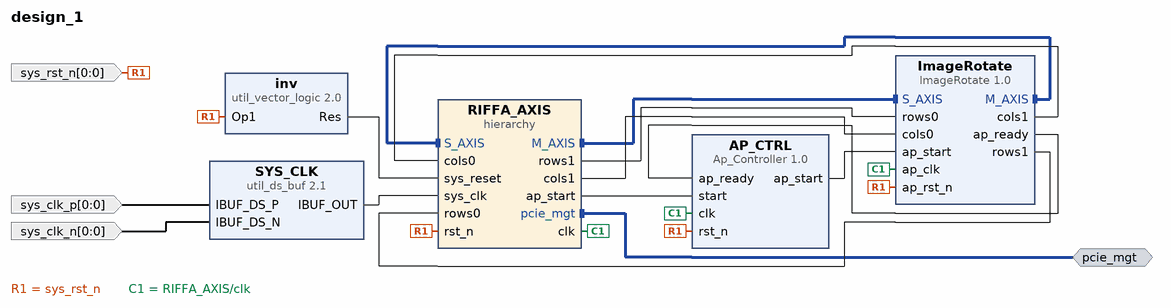
[diagram p0: block diagram of the top level]
# Vivado block design design_1, xc7vx690tffg1761-3, Vivado 2018.2
create_bd_design design_1

create_bd_intf_port -mode Master -vlnv xilinx.com:interface:pcie_7x_mgt_rtl:1.0 pcie_mgt
create_bd_port -dir I -from 0 -to 0 -type clk sys_clk_p
create_bd_port -dir I -from 0 -to 0 -type clk sys_clk_n
create_bd_port -dir I -from 0 -to 0 sys_rst_n

create_bd_cell -type hier RIFFA_AXIS
create_bd_cell -type ip -vlnv xilinx.com:ip:util_ds_buf:2.1 SYS_CLK
set_property -dict {CONFIG.C_BUF_TYPE IBUFDSGTE} [get_bd_cells SYS_CLK]
create_bd_cell -type ip -vlnv xilinx.com:hls:ImageRotate:1.0 ImageRotate
create_bd_cell -type ip -vlnv xilinx.com:user:Ap_Controller:1.0 AP_CTRL
create_bd_cell -type ip -vlnv xilinx.com:ip:util_vector_logic:2.0 inv
set_property -dict {CONFIG.C_SIZE 1 CONFIG.C_OPERATION not} [get_bd_cells inv]

# ---- hierarchy /RIFFA_AXIS ----
current_bd_instance /RIFFA_AXIS
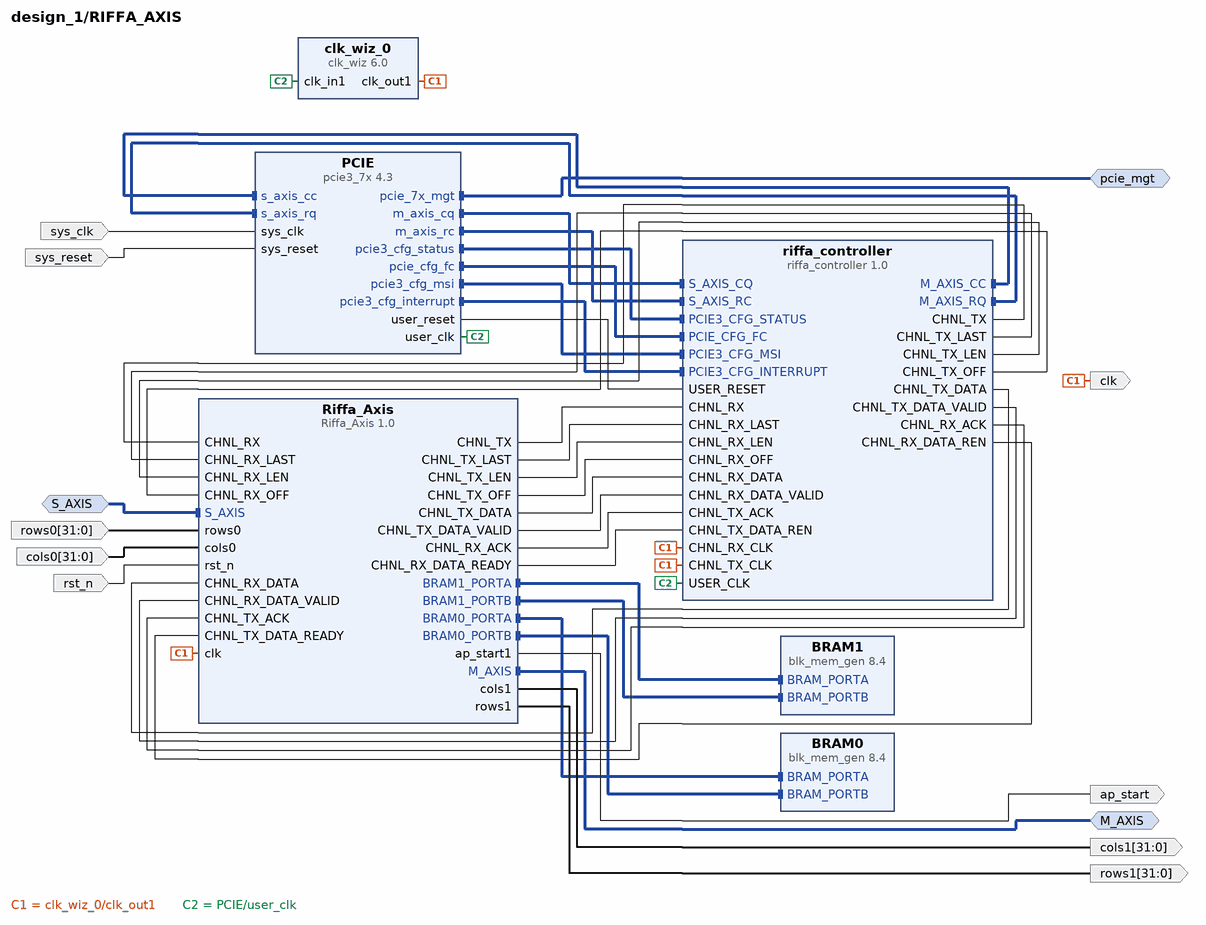
[diagram p1: block diagram inside /RIFFA_AXIS]
create_bd_intf_pin -mode Master -vlnv xilinx.com:interface:pcie_7x_mgt_rtl:1.0 pcie_mgt
create_bd_intf_pin -mode Master -vlnv xilinx.com:interface:axis_rtl:1.0 M_AXIS
create_bd_intf_pin -mode Slave -vlnv xilinx.com:interface:axis_rtl:1.0 S_AXIS
create_bd_pin -dir I -type clk sys_clk
create_bd_pin -dir I -type rst sys_reset
create_bd_pin -dir I -from 31 -to 0 rows0
create_bd_pin -dir I -from 31 -to 0 cols0
create_bd_pin -dir O -from 31 -to 0 rows1
create_bd_pin -dir O -from 31 -to 0 cols1
create_bd_pin -dir I -type rst rst_n
create_bd_pin -dir O -type clk clk
create_bd_pin -dir O ap_start

create_bd_cell -type ip -vlnv xilinx.com:ip:pcie3_7x:4.3 PCIE
set_property -dict [list \
  CONFIG.PL_LINK_CAP_MAX_LINK_SPEED 5.0_GT/s \
  CONFIG.PL_LINK_CAP_MAX_LINK_WIDTH X8 \
  CONFIG.AXISTEN_IF_RC_STRADDLE false \
  CONFIG.axisten_if_enable_client_tag false \
  CONFIG.PF0_DEVICE_ID 7028 \
  CONFIG.PF0_INTERRUPT_PIN NONE \
  CONFIG.PF1_DEVICE_ID 7011 \
  CONFIG.pcie_blk_locn X0Y1 \
  CONFIG.pf0_bar0_size 1 \
  CONFIG.pf0_dev_cap_max_payload 256_bytes \
  CONFIG.gen_x0y0 false \
  CONFIG.gen_x0y1 true \
  CONFIG.extended_tag_field true \
  CONFIG.axisten_if_width 128_bit \
  CONFIG.mode_selection Advanced \
  CONFIG.en_ext_clk false \
  CONFIG.tx_fc_if false \
  CONFIG.per_func_status_if false \
  CONFIG.cfg_mgmt_if false \
  CONFIG.rcv_msg_if false \
  CONFIG.cfg_tx_msg_if false \
  CONFIG.cfg_ctl_if false \
  CONFIG.tandem_mode None \
  CONFIG.axisten_freq 250 \
  CONFIG.aspm_support No_ASPM \
  CONFIG.pipe_mode_sim None \
] [get_bd_cells PCIE]
create_bd_cell -type ip -vlnv xilinx.com:user:riffa_controller:1.0 riffa_controller
create_bd_cell -type ip -vlnv xilinx.com:ip:blk_mem_gen:8.4 BRAM0
set_property -dict [list \
  CONFIG.Memory_Type Simple_Dual_Port_RAM \
  CONFIG.Enable_32bit_Address false \
  CONFIG.Use_Byte_Write_Enable false \
  CONFIG.Write_Width_A 8 \
  CONFIG.Write_Depth_A 65536 \
  CONFIG.Operating_Mode_A WRITE_FIRST \
  CONFIG.Enable_A Always_Enabled \
  CONFIG.Write_Width_B 128 \
  CONFIG.Read_Width_B 128 \
  CONFIG.Enable_B Use_ENB_Pin \
  CONFIG.Register_PortB_Output_of_Memory_Primitives false \
  CONFIG.Port_B_Clock 100 \
  CONFIG.Port_B_Enable_Rate 100 \
  CONFIG.use_bram_block Stand_Alone \
] [get_bd_cells BRAM0]
create_bd_cell -type ip -vlnv xilinx.com:ip:blk_mem_gen:8.4 BRAM1
set_property -dict [list \
  CONFIG.Memory_Type Simple_Dual_Port_RAM \
  CONFIG.Enable_32bit_Address false \
  CONFIG.Use_Byte_Write_Enable false \
  CONFIG.Write_Width_A 128 \
  CONFIG.Write_Depth_A 4096 \
  CONFIG.Operating_Mode_A NO_CHANGE \
  CONFIG.Enable_A Always_Enabled \
  CONFIG.Write_Width_B 8 \
  CONFIG.Read_Width_B 8 \
  CONFIG.Enable_B Use_ENB_Pin \
  CONFIG.Register_PortB_Output_of_Memory_Primitives false \
  CONFIG.Port_B_Clock 100 \
  CONFIG.Port_B_Enable_Rate 100 \
  CONFIG.use_bram_block Stand_Alone \
] [get_bd_cells BRAM1]
create_bd_cell -type ip -vlnv xilinx.com:ip:clk_wiz:6.0 clk_wiz_0
set_property -dict [list \
  CONFIG.PRIMITIVE PLL \
  CONFIG.PRIM_IN_FREQ 250.000 \
  CONFIG.CLKIN1_JITTER_PS 40.0 \
  CONFIG.CLKOUT1_REQUESTED_OUT_FREQ 50.000 \
  CONFIG.PRIM_SOURCE No_buffer \
  CONFIG.CLKOUT1_DRIVES BUFG \
  CONFIG.CLKOUT2_DRIVES BUFG \
  CONFIG.CLKOUT3_DRIVES BUFG \
  CONFIG.CLKOUT4_DRIVES BUFG \
  CONFIG.CLKOUT5_DRIVES BUFG \
  CONFIG.CLKOUT6_DRIVES BUFG \
  CONFIG.CLKOUT7_DRIVES BUFG \
  CONFIG.USE_LOCKED false \
  CONFIG.USE_RESET false \
  CONFIG.MMCM_DIVCLK_DIVIDE 5 \
  CONFIG.MMCM_CLKFBOUT_MULT_F 17 \
  CONFIG.MMCM_CLKIN1_PERIOD 4.000 \
  CONFIG.MMCM_CLKIN2_PERIOD 10.0 \
  CONFIG.MMCM_COMPENSATION ZHOLD \
  CONFIG.MMCM_CLKOUT0_DIVIDE_F 17 \
  CONFIG.CLKOUT1_JITTER 197.183 \
  CONFIG.CLKOUT1_PHASE_ERROR 155.540 \
] [get_bd_cells clk_wiz_0]
create_bd_cell -type ip -vlnv xilinx.com:user:Riffa_Axis:1.0 Riffa_Axis
set_property -dict {CONFIG.AP_CTRL_IN false} [get_bd_cells Riffa_Axis]

# ---- connections ----

current_bd_instance /RIFFA_AXIS
connect_bd_intf_net [get_bd_intf_pins Riffa_Axis/BRAM0_PORTA] [get_bd_intf_pins BRAM0/BRAM_PORTA]
connect_bd_intf_net [get_bd_intf_pins Riffa_Axis/BRAM0_PORTB] [get_bd_intf_pins BRAM0/BRAM_PORTB]
connect_bd_intf_net [get_bd_intf_pins Riffa_Axis/BRAM1_PORTA] [get_bd_intf_pins BRAM1/BRAM_PORTA]
connect_bd_intf_net [get_bd_intf_pins Riffa_Axis/BRAM1_PORTB] [get_bd_intf_pins BRAM1/BRAM_PORTB]
connect_bd_intf_net [get_bd_intf_pins PCIE/m_axis_cq] [get_bd_intf_pins riffa_controller/S_AXIS_CQ]
connect_bd_intf_net [get_bd_intf_pins PCIE/m_axis_rc] [get_bd_intf_pins riffa_controller/S_AXIS_RC]
connect_bd_intf_net [get_bd_intf_pins PCIE/s_axis_cc] [get_bd_intf_pins riffa_controller/M_AXIS_CC]
connect_bd_intf_net [get_bd_intf_pins riffa_controller/M_AXIS_RQ] [get_bd_intf_pins PCIE/s_axis_rq]
connect_bd_intf_net [get_bd_intf_pins riffa_controller/PCIE3_CFG_STATUS] [get_bd_intf_pins PCIE/pcie3_cfg_status]
connect_bd_intf_net [get_bd_intf_pins riffa_controller/PCIE_CFG_FC] [get_bd_intf_pins PCIE/pcie_cfg_fc]
connect_bd_intf_net [get_bd_intf_pins PCIE/pcie3_cfg_msi] [get_bd_intf_pins riffa_controller/PCIE3_CFG_MSI]
connect_bd_intf_net [get_bd_intf_pins PCIE/pcie3_cfg_interrupt] [get_bd_intf_pins riffa_controller/PCIE3_CFG_INTERRUPT]
connect_bd_intf_net [get_bd_intf_pins pcie_mgt] [get_bd_intf_pins PCIE/pcie_7x_mgt]
connect_bd_intf_net [get_bd_intf_pins M_AXIS] [get_bd_intf_pins Riffa_Axis/M_AXIS]
connect_bd_intf_net [get_bd_intf_pins S_AXIS] [get_bd_intf_pins Riffa_Axis/S_AXIS]
connect_bd_net [get_bd_pins riffa_controller/CHNL_TX] [get_bd_pins Riffa_Axis/CHNL_RX]
connect_bd_net [get_bd_pins riffa_controller/CHNL_TX_LAST] [get_bd_pins Riffa_Axis/CHNL_RX_LAST]
connect_bd_net [get_bd_pins riffa_controller/CHNL_TX_LEN] [get_bd_pins Riffa_Axis/CHNL_RX_LEN]
connect_bd_net [get_bd_pins riffa_controller/CHNL_TX_OFF] [get_bd_pins Riffa_Axis/CHNL_RX_OFF]
connect_bd_net [get_bd_pins riffa_controller/CHNL_TX_DATA] [get_bd_pins Riffa_Axis/CHNL_RX_DATA]
connect_bd_net [get_bd_pins riffa_controller/CHNL_TX_DATA_VALID] [get_bd_pins Riffa_Axis/CHNL_RX_DATA_VALID]
connect_bd_net [get_bd_pins riffa_controller/CHNL_RX_ACK] [get_bd_pins Riffa_Axis/CHNL_TX_ACK]
connect_bd_net [get_bd_pins riffa_controller/CHNL_RX_DATA_REN] [get_bd_pins Riffa_Axis/CHNL_TX_DATA_READY]
connect_bd_net [get_bd_pins Riffa_Axis/CHNL_TX] [get_bd_pins riffa_controller/CHNL_RX]
connect_bd_net [get_bd_pins Riffa_Axis/CHNL_TX_LAST] [get_bd_pins riffa_controller/CHNL_RX_LAST]
connect_bd_net [get_bd_pins Riffa_Axis/CHNL_TX_LEN] [get_bd_pins riffa_controller/CHNL_RX_LEN]
connect_bd_net [get_bd_pins Riffa_Axis/CHNL_TX_OFF] [get_bd_pins riffa_controller/CHNL_RX_OFF]
connect_bd_net [get_bd_pins Riffa_Axis/CHNL_TX_DATA] [get_bd_pins riffa_controller/CHNL_RX_DATA]
connect_bd_net [get_bd_pins Riffa_Axis/CHNL_TX_DATA_VALID] [get_bd_pins riffa_controller/CHNL_RX_DATA_VALID]
connect_bd_net [get_bd_pins Riffa_Axis/CHNL_RX_ACK] [get_bd_pins riffa_controller/CHNL_TX_ACK]
connect_bd_net [get_bd_pins Riffa_Axis/CHNL_RX_DATA_READY] [get_bd_pins riffa_controller/CHNL_TX_DATA_REN]
connect_bd_net [get_bd_pins PCIE/user_reset] [get_bd_pins riffa_controller/USER_RESET]
connect_bd_net -net sys_clk_0_1 [get_bd_pins sys_clk] [get_bd_pins PCIE/sys_clk]
connect_bd_net -net sys_reset_0_1 [get_bd_pins sys_reset] [get_bd_pins PCIE/sys_reset]
connect_bd_net -net rows0_0_1 [get_bd_pins rows0] [get_bd_pins Riffa_Axis/rows0]
connect_bd_net -net cols0_0_1 [get_bd_pins cols0] [get_bd_pins Riffa_Axis/cols0]
connect_bd_net [get_bd_pins Riffa_Axis/rows1] [get_bd_pins rows1]
connect_bd_net [get_bd_pins Riffa_Axis/cols1] [get_bd_pins cols1]
connect_bd_net -net rst_n_0_1 [get_bd_pins rst_n] [get_bd_pins Riffa_Axis/rst_n]
connect_bd_net [get_bd_pins clk_wiz_0/clk_out1] \
  [get_bd_pins clk] [get_bd_pins riffa_controller/CHNL_TX_CLK] [get_bd_pins riffa_controller/CHNL_RX_CLK] \
  [get_bd_pins Riffa_Axis/clk]
connect_bd_net [get_bd_pins PCIE/user_clk] [get_bd_pins clk_wiz_0/clk_in1] [get_bd_pins riffa_controller/USER_CLK]
connect_bd_net [get_bd_pins Riffa_Axis/ap_start1] [get_bd_pins ap_start]

current_bd_instance /
connect_bd_intf_net [get_bd_intf_pins ImageRotate/M_AXIS] [get_bd_intf_pins RIFFA_AXIS/S_AXIS]
connect_bd_intf_net [get_bd_intf_pins ImageRotate/S_AXIS] [get_bd_intf_pins RIFFA_AXIS/M_AXIS]
connect_bd_intf_net [get_bd_intf_ports pcie_mgt] [get_bd_intf_pins RIFFA_AXIS/pcie_mgt]
connect_bd_net -net IBUF_DS_P_0_1 [get_bd_ports sys_clk_p] [get_bd_pins SYS_CLK/IBUF_DS_P]
connect_bd_net -net IBUF_DS_N_0_1 [get_bd_ports sys_clk_n] [get_bd_pins SYS_CLK/IBUF_DS_N]
connect_bd_net -net din_0_1 [get_bd_ports sys_rst_n] \
  [get_bd_pins ImageRotate/ap_rst_n] [get_bd_pins RIFFA_AXIS/rst_n] [get_bd_pins AP_CTRL/rst_n] [get_bd_pins inv/Op1]
connect_bd_net [get_bd_pins SYS_CLK/IBUF_OUT] [get_bd_pins RIFFA_AXIS/sys_clk]
connect_bd_net [get_bd_pins RIFFA_AXIS/clk] [get_bd_pins ImageRotate/ap_clk] [get_bd_pins AP_CTRL/clk]
connect_bd_net [get_bd_pins RIFFA_AXIS/rows1] [get_bd_pins ImageRotate/rows0]
connect_bd_net [get_bd_pins RIFFA_AXIS/cols1] [get_bd_pins ImageRotate/cols0]
connect_bd_net [get_bd_pins ImageRotate/cols1] [get_bd_pins RIFFA_AXIS/cols0]
connect_bd_net [get_bd_pins ImageRotate/rows1] [get_bd_pins RIFFA_AXIS/rows0]
connect_bd_net -net Ap_Controller_ap_start [get_bd_pins AP_CTRL/ap_start] [get_bd_pins ImageRotate/ap_start]
connect_bd_net [get_bd_pins ImageRotate/ap_ready] [get_bd_pins AP_CTRL/ap_ready]
connect_bd_net [get_bd_pins inv/Res] [get_bd_pins RIFFA_AXIS/sys_reset]
connect_bd_net [get_bd_pins RIFFA_AXIS/ap_start] [get_bd_pins AP_CTRL/start]

validate_bd_design
save_bd_design
